# EAGLE design pcb1 (EAGLE 8.3.1)
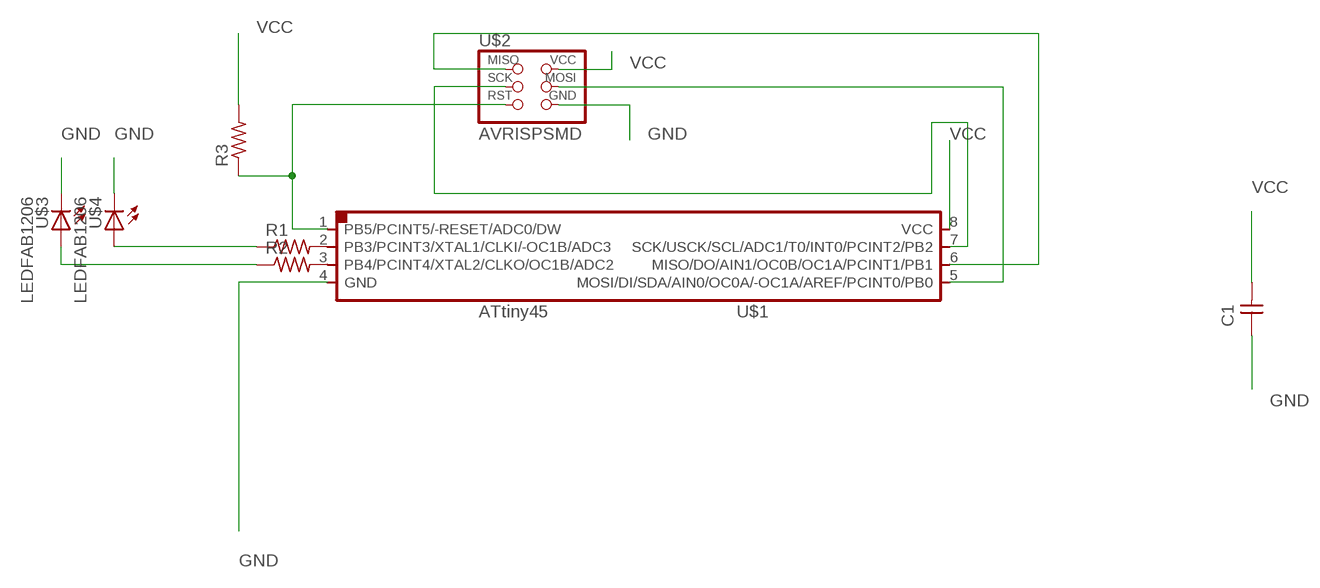
[diagram p0: schematic, sheet 1]

## Parts
C1  CAP-UNPOLARIZED  [C1206]
R1  RES-US1206FAB  [R1206FAB]
R2  RES-US1206FAB  [R1206FAB]
R3  RES-US1206FAB  [R1206FAB]
U$1  ATTINY45SI  [SOIC8]
U$2  AVRISPSMD  [2X03SMD]
U$3  LEDFAB1206  [LED1206FAB]
U$4  LEDFAB1206  [LED1206FAB]

## Nets
GND: C1.1 U$1.4(GND) U$2.6(GND) U$3.2(C) U$4.2(C)
N$1: U$1.6(MISO/DO/AIN1/OC0B/OC1A/PCINT1/PB1) U$2.1(MISO)
N$2: R1.2 U$1.2(PB3/PCINT3/XTAL1/CLKI/-OC1B/ADC3)
N$3: U$1.7(SCK/USCK/SCL/ADC1/T0/INT0/PCINT2/PB2) U$2.3(SCK)
N$4: R3.1 U$1.1(PB5/PCINT5/-RESET/ADC0/DW) U$2.5(RST)
N$5: R2.2 U$1.3(PB4/PCINT4/XTAL2/CLKO/OC1B/ADC2)
N$6: R1.1 U$4.1(A)
N$7: U$1.5(MOSI/DI/SDA/AIN0/OC0A/-OC1A/AREF/PCINT0/PB0) U$2.4(MOSI)
N$8: R2.1 U$3.1(A)
VCC: C1.2 R3.2 U$1.8(VCC) U$2.2(VCC)

## Library data of the parts
C1 = fab:CAP-UNPOLARIZED
R1-R3 = fab:RES-US: Resistor (US Symbol) Variants with postfix FAB are widened to allow the routing of internal traces
U$1 = fab:ATTINY45
U$2 = fab:AVRISP
U$3 U$4 = fab:LED: LED

## Board
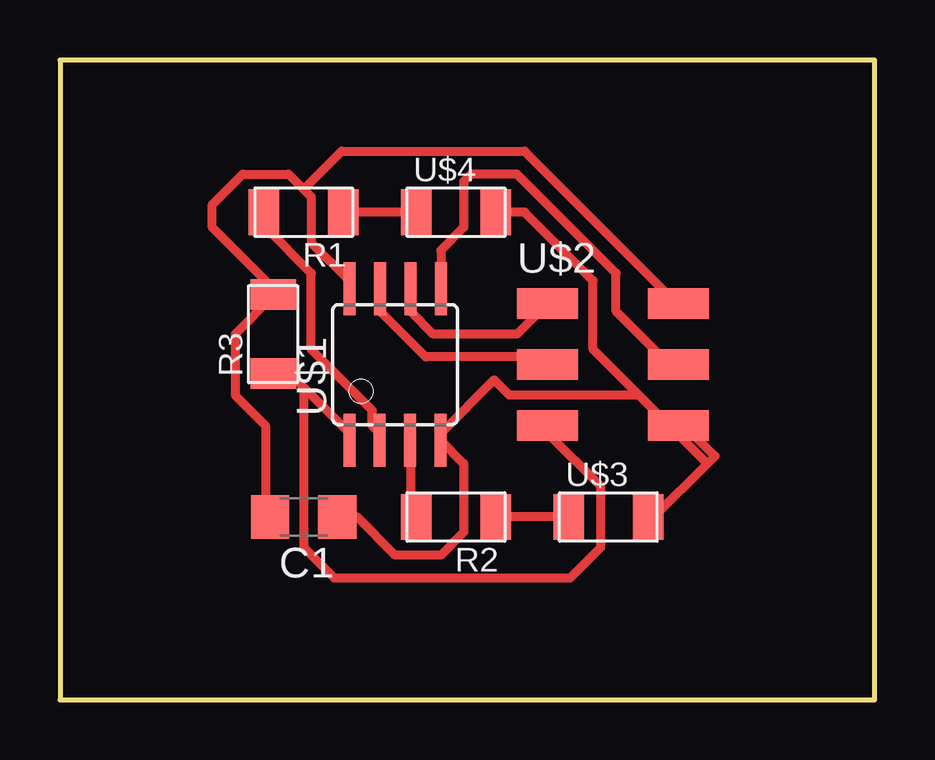
[diagram p1: board, top side]

Size 33.96 x 26.66 mm. Coordinates in mm from the lower left corner, seen from the top.
Outline: 0,0 33.96,0 33.96,26.66 0,26.66 0,0
Copper layers (1*16): Top 0.035mm / dielectric 1.5mm / Bottom 0.035mm
Design rules "default *": minimum track width 15mil, minimum drill 0.35mm, track to track 15mil, track to pad 15mil, pad to pad 15mil, via to via 15mil, smd to smd 15mil, copper to edge 40mil, drill to drill 6mil, minimum pad ring 10mil, minimum via ring 8mil, stop-mask expansion 4mil, vias tented up to drill 0mil, thermal gap 10mil

### Footprints (pad centres in the part's own frame; a part is rotated, then mirrored left to right if it is on the bottom)
C1206 = smd 1.6 x 1.8: 1 -1.4,0; 2 1.4,0
R1206FAB = smd 1.27 x 1.905: 1 -1.651,0; 2 1.651,0
SOIC8 = smd 0.5 x 2.2: 1 -1.905,-3.154; 2 -0.645,-3.154; 3 0.625,-3.154; 4 1.895,-3.154; 5 1.905,3.154; 6 0.635,3.154; 7 -0.635,3.154; 8 -1.905,3.154
2X03SMD = smd 2.54 x 1.27: 1 -2.54,2.54; 2 2.92,2.54; 3 -2.54,0; 4 2.92,0; 5 -2.54,-2.54; 6 2.92,-2.54
LED1206FAB = smd 1.27 x 1.905: 1 -1.651,0; 2 1.651,0

### Placement (x,y rotation side)
C1  10.16,7.62 180 top
R1  10.16,20.32 180 top
R2  16.51,7.62 180 top
R3  8.89,15.24 90 top
U$1  13.97,13.97 0 top
U$2  22.86,13.97 0 top
U$3  22.86,7.62 0 top
U$4  16.51,20.32 0 top

### Tracks (layer width: path | path; a pad name or v marks a point on that pad's centre or on a via)
GND
  Top 0.381: C1.1 12.38,7.62 13.97,6.03 15.88,6.03 16.83,6.98 16.83,9.84 15.88,10.79 U$1.4 15.88,11.11 18.1,13.34 18.73,12.7 24.13,12.7 | 26.99,9.84 27.3,10.16 26.03,11.43 U$2.6 | 26.99,9.84 24.77,7.62 U$3.2 | U$4.2 19.37,20.32 22.23,17.46 22.23,14.61 24.13,12.7 | 26.99,9.84 24.13,12.7
N$1
  Top 0.381: U$1.6 14.61,16.19 15.56,15.24 19.05,15.24 U$2.1
N$2
  Top 0.381: R1.2 8.57,20.32 8.57,19.68 10.48,17.78 10.48,14.61 13.02,12.07 13.02,11.43 13.34,11.11 U$1.2
N$3
  Top 0.381: U$1.7 13.34,16.19 15.24,14.29 20,14.29 U$2.3
N$4
  Top 0.381: 10.16,13.02 12.07,11.11 U$1.1 | 10.16,13.02 9.84,13.34 8.89,13.34 R3.1 | U$2.5 20.32,11.11 22.54,8.89 22.54,6.35 21.27,5.08 11.43,5.08 10.16,6.35 10.16,13.02
N$5
  Top 0.381: R2.2 14.61,7.62 14.61,10.79 U$1.3
N$6
  Top 0.381: U$4.1 R1.1
N$7
  Top 0.381: U$1.5 15.88,18.73 16.83,19.68 16.83,21.59 17.14,21.91 19.05,21.91 23.18,17.78 23.18,16.19 25.4,13.97 U$2.4
N$8
  Top 0.381: U$3.1 R2.1
VCC
  Top 0.381: C1.2 8.57,7.62 8.57,11.43 7.3,12.7 7.3,15.24 8.89,16.83 R3.2 8.89,17.14 6.35,19.68 6.35,20.64 7.62,21.91 9.53,21.91 10.16,21.27 | U$1.8 12.07,17.46 10.48,19.05 10.48,20.95 10.16,21.27 | 10.16,21.27 11.75,22.86 19.37,22.86 25.72,16.51 U$2.2